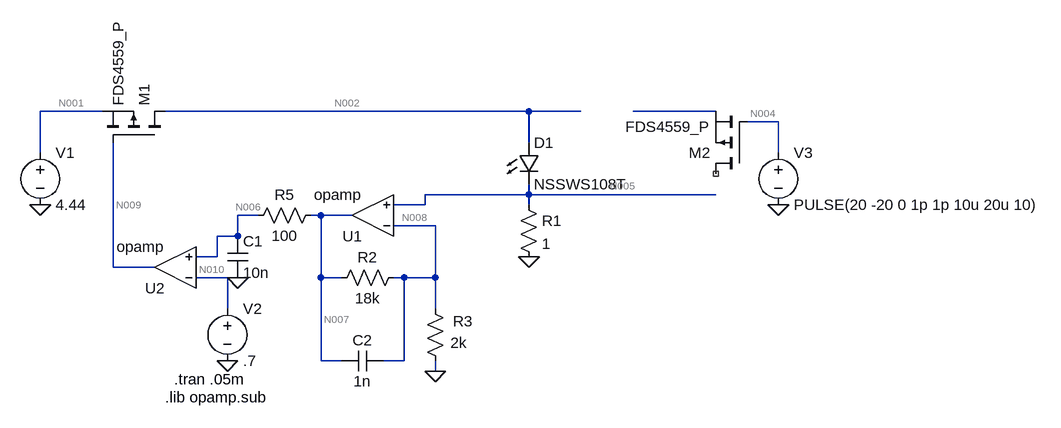
[diagram p0: schematic LED driver simulation, 0.1V dropout.asc]
LED driver simulation, 0.1V dropout.asc, the LTspice schematic file:
Version 4
SHEET 1 1200 680
WIRE -288 -16 -384 -16
WIRE 368 -16 -192 -16
WIRE 448 -16 368 -16
WIRE 656 -16 528 -16
WIRE 752 0 704 0
WIRE 368 32 368 -16
WIRE -384 48 -384 -16
WIRE 752 48 752 0
WIRE 368 112 368 96
WIRE 368 112 208 112
WIRE 656 112 368 112
WIRE 208 128 208 112
WIRE 208 128 160 128
WIRE 368 128 368 112
WIRE -48 144 -80 144
WIRE 48 144 32 144
WIRE 96 144 48 144
WIRE 224 160 160 160
WIRE -80 176 -80 144
WIRE -80 176 -112 176
WIRE -112 208 -112 176
WIRE -112 208 -144 208
WIRE -272 224 -272 32
WIRE -208 224 -272 224
WIRE -96 240 -144 240
WIRE 48 240 48 144
WIRE 80 240 48 240
WIRE 176 240 160 240
WIRE 224 240 224 160
WIRE 224 240 176 240
WIRE -96 288 -96 240
WIRE 224 288 224 240
WIRE 48 368 48 240
WIRE 80 368 48 368
WIRE 176 368 176 240
WIRE 176 368 144 368
WIRE 224 384 224 368
FLAG 368 208 0
FLAG -384 128 0
FLAG 224 384 0
FLAG -96 368 0
FLAG 752 128 0
FLAG -80 240 0
SYMBOL LED 352 32 R0
SYMATTR InstName D1
SYMATTR Value NSSWS108T
SYMATTR Description Diode
SYMATTR Type diode
SYMBOL res 352 112 R0
SYMATTR InstName R1
SYMATTR Value 1
SYMBOL pmos -192 32 M270
SYMATTR InstName M1
SYMATTR Value FDS4559_P
SYMBOL voltage -384 32 R0
WINDOW 123 0 0 Left 0
WINDOW 39 0 0 Left 0
SYMATTR InstName V1
SYMATTR Value 4.44
SYMBOL Opamps\\opamp 128 208 R180
SYMATTR InstName U1
SYMBOL Opamps\\opamp -176 288 R180
SYMATTR InstName U2
SYMBOL res 176 224 R90
WINDOW 0 0 56 VBottom 0
WINDOW 3 32 56 VTop 0
SYMATTR InstName R2
SYMATTR Value 18k
SYMBOL res 240 384 R180
WINDOW 0 -42 77 Left 0
WINDOW 3 -33 44 Left 0
SYMATTR InstName R3
SYMATTR Value 2k
SYMBOL voltage -96 272 R0
WINDOW 123 0 0 Left 0
WINDOW 39 24 132 Left 0
SYMATTR InstName V2
SYMATTR Value .7
SYMBOL cap 144 352 R90
WINDOW 0 0 32 VBottom 0
WINDOW 3 32 32 VTop 0
SYMATTR InstName C2
SYMATTR Value 1n
SYMBOL pmos 704 80 R180
SYMATTR InstName M2
SYMATTR Value FDS4559_P
SYMBOL voltage 752 32 R0
WINDOW 123 0 0 Left 0
WINDOW 39 0 0 Left 0
SYMATTR InstName V3
SYMATTR Value PULSE(20 -20 0 1p 1p 10u 20u 10)
SYMBOL res 48 128 R90
WINDOW 0 0 56 VBottom 0
WINDOW 3 32 56 VTop 0
SYMATTR InstName R5
SYMATTR Value 100
SYMBOL cap -96 176 R0
SYMATTR InstName C1
SYMATTR Value 10n
TEXT -192 424 Left 0 !.lib opamp.sub
TEXT -178 396 Left 0 !.tran .05m

The netlist it stands for:
* LED driver simulation, 0.1V dropout.asc
D1 N002 N005 NSSWS108T
R1 N005 0 1
M1 N002 N009 N001 N001 FDS4559_P
V1 N001 0 4.44
XU1 N008 N005 N007 opamp Aol=100K GBW=10Meg  ; pins invin noninvin out
XU2 N010 N006 N009 opamp Aol=100K GBW=10Meg  ; pins invin noninvin out
R2 N008 N007 18k
R3 0 N008 2k
V2 N010 0 .7
C2 N008 N007 1n
M2 NC_01 N004 N003 N003 FDS4559_P
V3 N004 0 PULSE(20 -20 0 1p 1p 10u 20u 10)
R5 N007 N006 100
C1 N006 0 10n
.model D D
.lib standard.dio
.model NMOS NMOS
.model PMOS PMOS
.lib standard.mos
.lib opamp.sub
.tran .05m
.backanno
.end

* Results of the author's LTspice run, read from the files saved beside the schematic
* Operating Point, zero values left out:
*   V(n002) = 4.133 V
*   V(n005) = 70.01 mV
*   V(n009) = 1.815 V
*   V(n001) = 4.44 V
*   V(n007) = 700 mV
*   V(n008) = 70 mV
*   V(n006) = 700 mV
*   V(n010) = 700 mV
*   V(n004) = 20 V
*   I(D1) = 70.01 mA
*   I(R5) = -1.152 pA
*   I(R3) = -35 µA
*   I(R2) = -35 µA
*   I(R1) = 70.01 mA
*   I(V1) = -70.01 mA
*   Id(M1) = -70.01 mA
*   Is(M1) = 70.01 mA
*   Ix(u1:3) = -35 µA
*   Ix(u2:3) = 3.428 pA